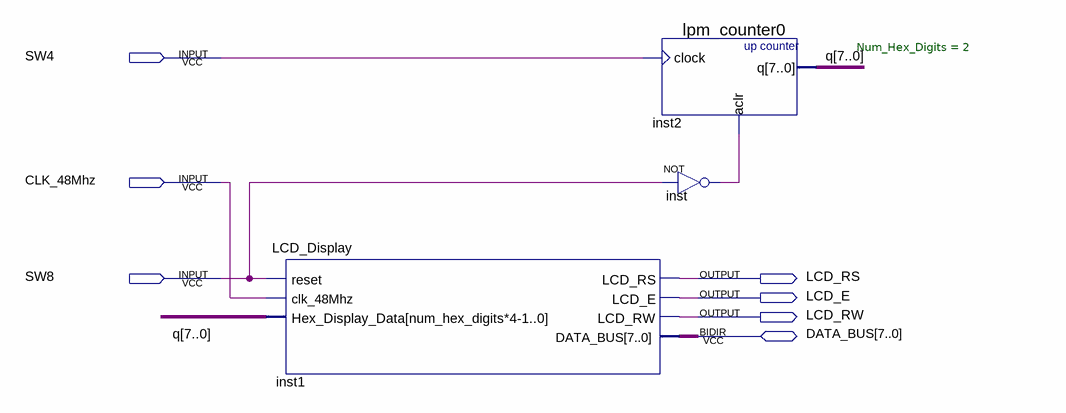
[diagram p0: schematic sheet]
// Quartus schematic tutor2.bdf as structural Verilog: 3 symbols, 7 pins
module tutor2 (
  input  SW4,
  input  CLK_48Mhz,
  input  SW8,
  inout  [7:0] DATA_BUS,
  output LCD_RS,
  output LCD_E,
  output LCD_RW
);

  wire inst_out;
  wire [7:0] q;

  LCD_Display #(.Num_Hex_Digits(2)) inst1 (
    .reset(SW8), .clk_48Mhz(CLK_48Mhz), .Hex_Display_Data(q), .LCD_RS(LCD_RS), .LCD_E(LCD_E),
    .LCD_RW(LCD_RW), .DATA_BUS(DATA_BUS));
  lpm_counter0 inst2 (.clock(SW4), .aclr(inst_out), .q(q));
  not inst (inst_out, SW8);
endmodule
